# EasyEDA Pro project ProProject_8通道遥控器控制板_2024-05-28.epro

# Schematic schematic1
Create Date: 2024-05-23; Page Name: P1; Project Name: 8通道遥控器控制板; Schematic Name: schematic1; Update Date: 2024-05-23; Company: 嘉立创EDA; Drawed: Date20240523; Page Size: A4; Version: V1.0
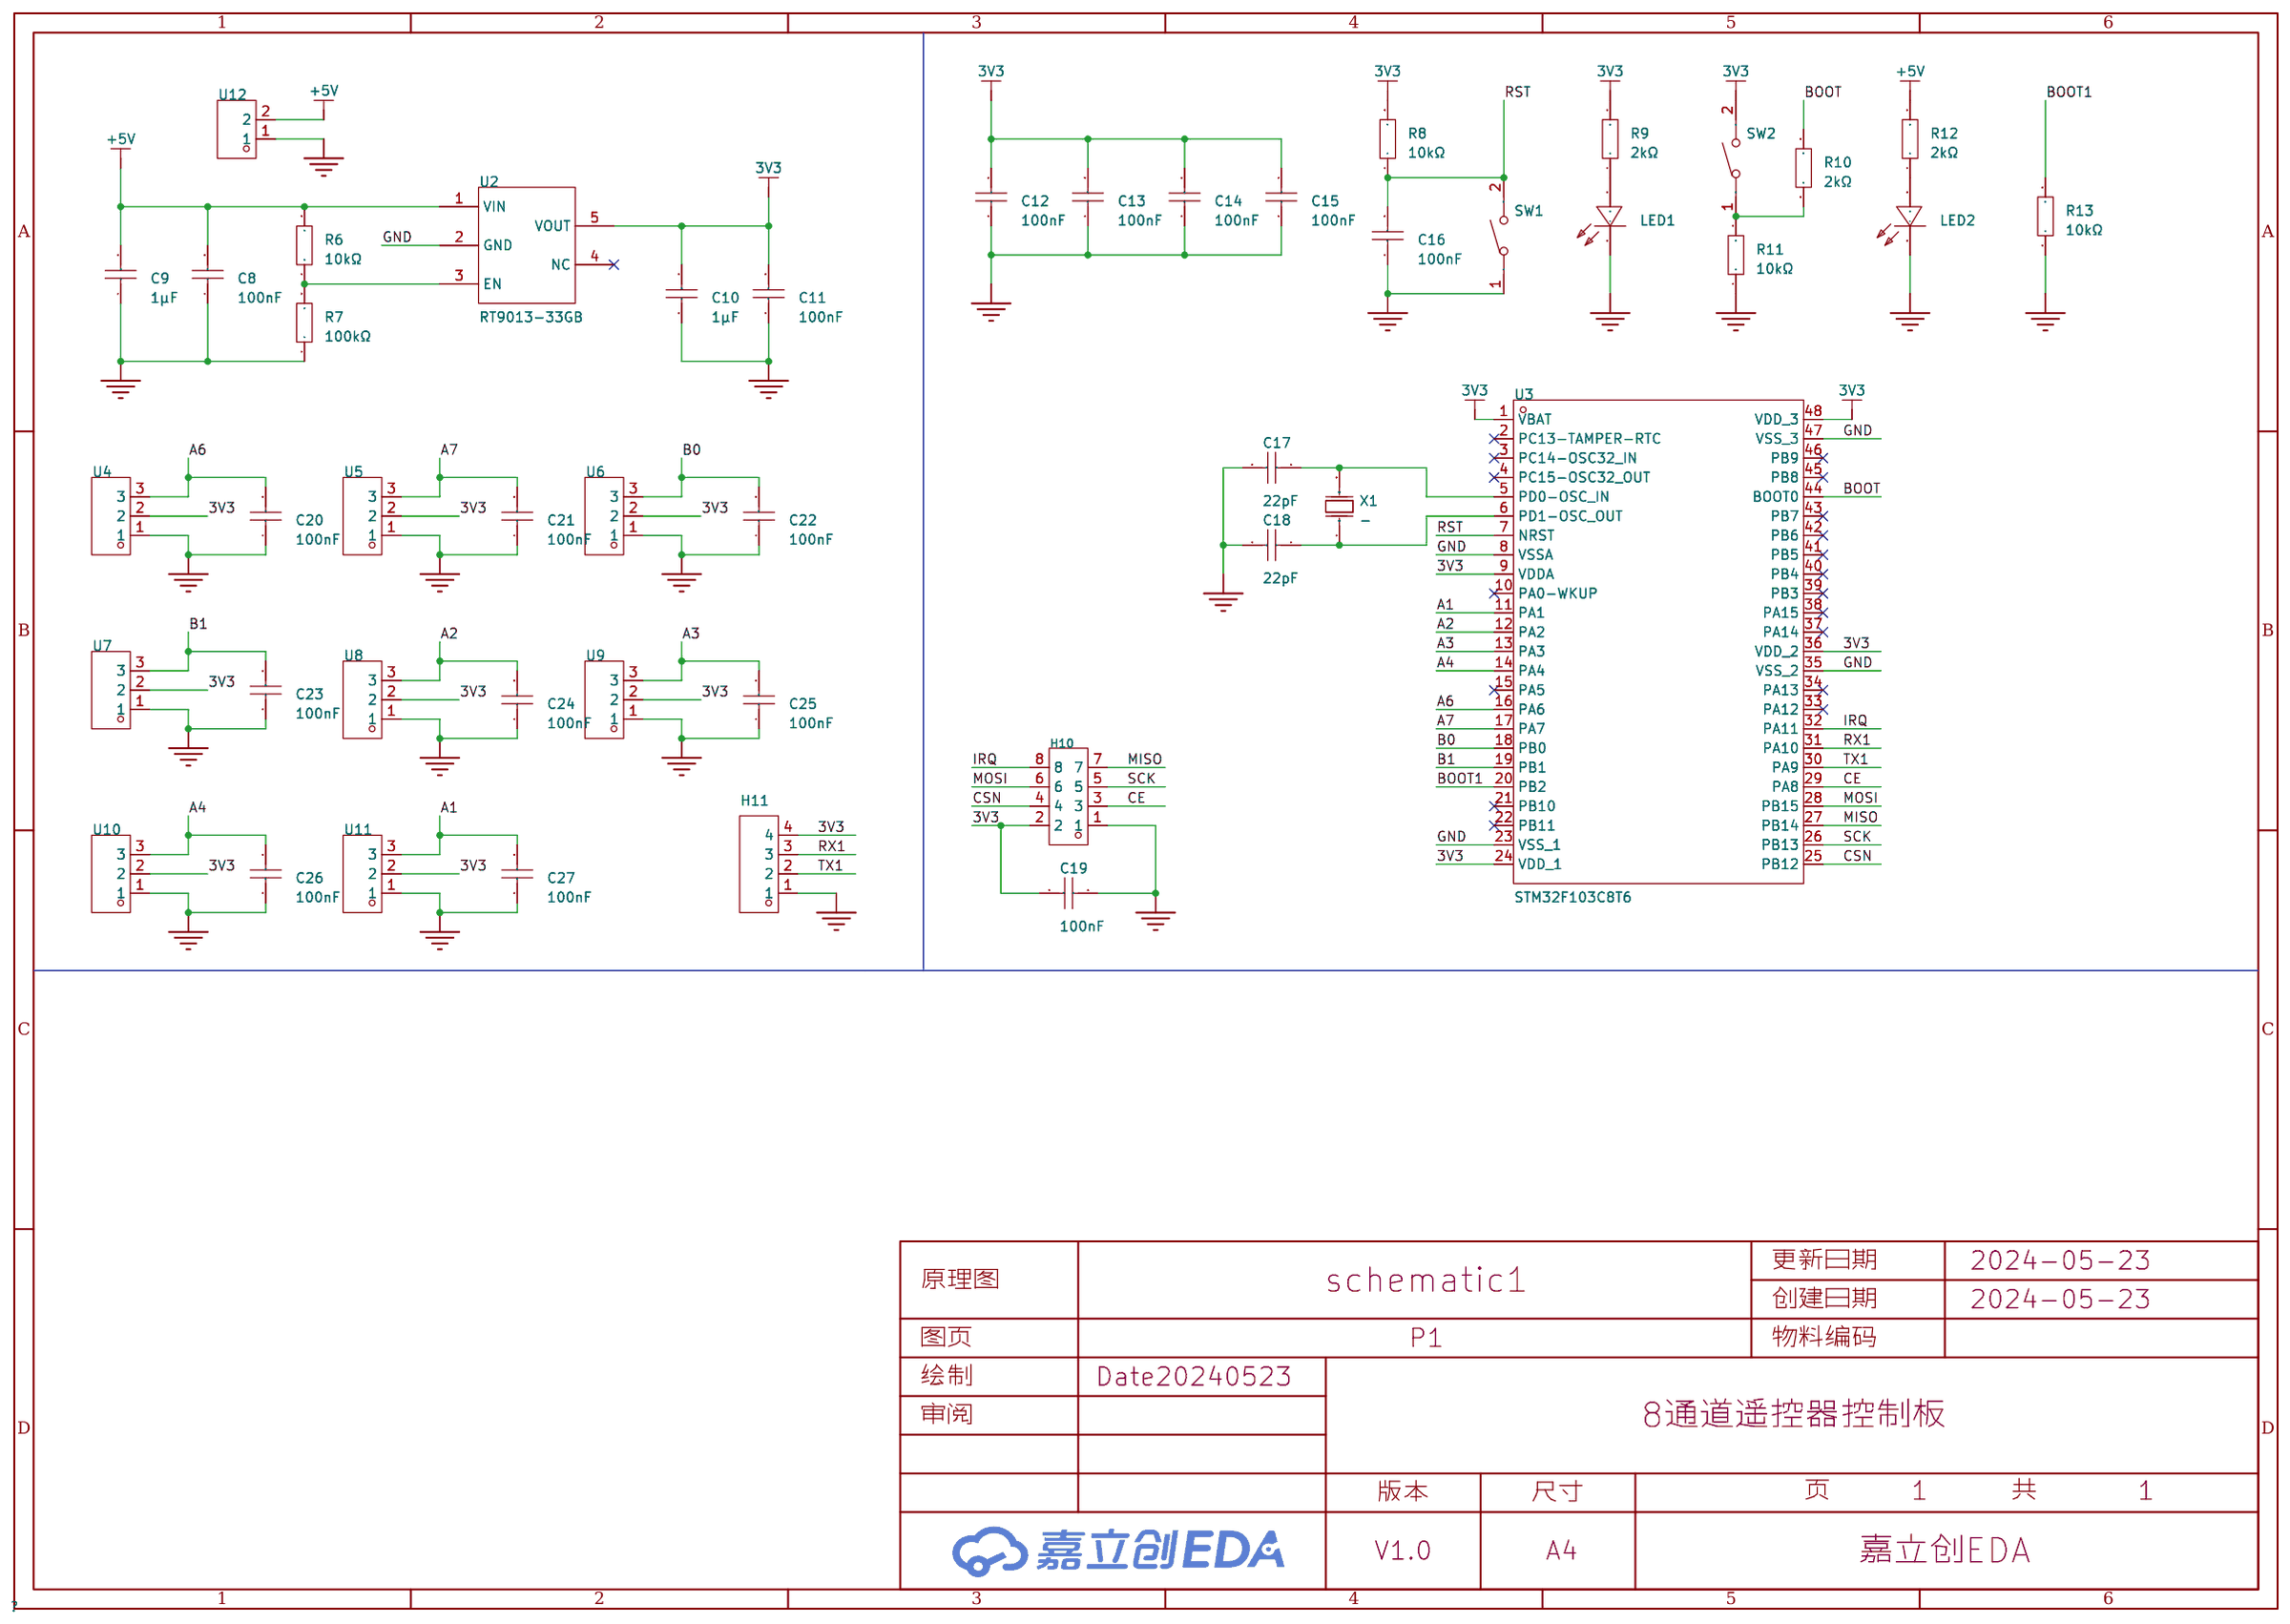
[diagram p0: schematic sheet]

## Parts
C8  100nF  [C0805]
C9  1μF  [C0805]
C10  1μF  [C0805]
C11  100nF  [C0805]
C12  100nF  [C0805]
C13  100nF  [C0805]
C14  100nF  [C0805]
C15  100nF  [C0805]
C16  100nF  [C0805]
C17  22pF  [C0805]
C18  22pF  [C0805]
C19  100nF  [C0805]
C20  100nF  [C0805]
C21  100nF  [C0805]
C22  100nF  [C0805]
C23  100nF  [C0805]
C24  100nF  [C0805]
C25  100nF  [C0805]
C26  100nF  [C0805]
C27  100nF  [C0805]
H10  PZ254V-12-8P  [HDR-TH_8P-P2.54-V-M-R2-C4-S2.54]
H11  PZ254V-11-04P  [HDR-TH_4P-P2.54-V-M]
LED1  SZYY0603G  [LED0603-R-RD_GREEN]
LED2  SZYY0603G  [LED0603-R-RD_GREEN]
R6  10kΩ  [R0603]
R7  100kΩ  [R0603]
R8  10kΩ  [R0603]
R9  2kΩ  [R0603]
R10  2kΩ  [R0603]
R11  10kΩ  [R0603]
R12  2kΩ  [R0603]
R13  10kΩ  [R0603]
SW1  TS-1088-AR02016  [SW-SMD_L3.9-W3.0-P4.45]
SW2  TS-1088-AR02016  [SW-SMD_L3.9-W3.0-P4.45]
U2  RT9013-33GB  [SOT-23-5_L3.0-W1.7-P0.95-LS2.8-BL]
U3  STM32F103C8T6  [LQFP-48_L7.0-W7.0-P0.50-LS9.0-BL]
U4  ZX-XH2.54-3PZZ  [CONN-TH_3P-P2.54_2501S-3P]
U5  ZX-XH2.54-3PZZ  [CONN-TH_3P-P2.54_2501S-3P]
U6  ZX-XH2.54-3PZZ  [CONN-TH_3P-P2.54_2501S-3P]
U7  ZX-XH2.54-3PZZ  [CONN-TH_3P-P2.54_2501S-3P]
U8  ZX-XH2.54-3PZZ  [CONN-TH_3P-P2.54_2501S-3P]
U9  ZX-XH2.54-3PZZ  [CONN-TH_3P-P2.54_2501S-3P]
U10  ZX-XH2.54-3PZZ  [CONN-TH_3P-P2.54_2501S-3P]
U11  ZX-XH2.54-3PZZ  [CONN-TH_3P-P2.54_2501S-3P]
U12  DB125-3.81-2P-GN-S  [CONN-TH_2P-P3.81_L7.4-W7.6]
X1  -  [HC-49S_L11.4-W4.8]

## Library data of the parts
C8-C27 = CC0805KRX7R9BB104: 容值:100nF;精度:±10%;额定电压:50V;材质(温度系数):X7R;; LCSC Part Name: 100nF ±10% 50V; Supplier Part: C49678; Manufacturer: YAGEO(国巨); Supplier Footprint: 0805; JLCPCB Part Class: 基础库; Datasheet: https://atta.szlcsc.com/upload/public/pdf/source/20180224/C181747_15194369449651363981.pdf; Supplier: LCSC; Tolerance: ±10%; Voltage Rated: 50V; Temperature Coefficient: X7R
H10 = PZ254V-12-8P: 插针结构:2x4P;间距:2.54mm;行距:2.54mm;圆针/方针:方针;安装类型:直插;排数:双排;总PIN位数:8P;额定电流:-;额定电压:-;配合针长度:6mm;塑高:2.5mm;端接针长度:3mm;触头材质:黄铜;触头镀层:-;工作温度范围:-40℃~+105℃;颜色:黑色;; LCSC Part Name: 间距:2.54mm 2x4P 直插 方针; Supplier Part: C492421; Manufacturer: XFCN(兴飞); Supplier Footprint: 插件,P=2.54mm; JLCPCB Part Class: 扩展库; Datasheet: https://atta.szlcsc.com/upload/public/pdf/source/20200309/C492421_DC8A206AF99CD7755BD4A5B0BC48200B.pdf; Supplier: LCSC; Pin Structure: 2x4P; Pitch: 2.54mm; Row Spacing: 2.54mm; Circluar Pins/Square Pins: 方针; Mounting Type: 直插; Number of Rows: 双排; Number of Pins: 8P; Length of Mating Pin: 6mm; Insulation Height: 2.5mm; Length of End Connection Pin: 3mm; Contact Material: 黄铜; Operating Temperature Range: -40℃~+105℃; Color: 黑色
H11 = PZ254V-11-04P: 插针结构:1x4P;间距:2.54mm;行距:-;圆针/方针:方针;安装类型:直插;排数:单排;总PIN位数:4P;额定电流:3A;额定电压:250V;配合针长度:6mm;塑高:2.5mm;端接针长度:3mm;触头材质:-;工作温度范围:-40℃~+105℃;颜色:黑色;; LCSC Part Name: 间距:2.54mm 1x4P 直插 方针; Supplier Part: C2691448; Manufacturer: XFCN(兴飞); Supplier Footprint: 插件,P=2.54mm; JLCPCB Part Class: 扩展库; Datasheet: https://atta.szlcsc.com/upload/public/pdf/source/20200309/C492403_F9F19131791D08044AD4F84F8E751A34.pdf; Supplier: LCSC; Pin Structure: 1x4P; Pitch: 2.54mm; Circluar Pins/Square Pins: 方针; Mounting Type: 直插; Number of Rows: 单排; Number of Pins: 4P; Current Rating (Max): 3A; Voltage Rating (Max): 250V; Length of Mating Pin: 6mm; Insulation Height: 2.5mm; Length of End Connection Pin: 3mm; Operating Temperature Range: -40℃~+105℃; Color: 黑色
LED1 LED2 = SZYY0603G: 发光颜色:翠绿色;; LCSC Part Name: 翠绿; Supplier Part: C434420; Manufacturer: yongyu(永裕光电); Supplier Footprint: 0603; JLCPCB Part Class: 扩展库; Datasheet: https://atta.szlcsc.com/upload/public/pdf/source/20191204/C434420_28D8AC31297B1E2177F31D28DAFFED5A.pdf; Supplier: LCSC; Emitted Color: 翠绿色
R6-R13 = 0603WAF1001T5E: 电阻类型:厚膜电阻;阻值:1kΩ;精度:±1%;功率:100mW;最大工作电压:75V;温度系数:±100ppm/℃;; LCSC Part Name: 1kΩ ±1% 100mW 厚膜电阻; Supplier Part: C21190; Manufacturer: UNI-ROYAL(厚声); Supplier Footprint: 0603; JLCPCB Part Class: 基础库; Datasheet: https://atta.szlcsc.com/upload/public/pdf/source/20200306/C422600_1E6D84923E4A46A82E41ADD87F860B5C.pdf; Supplier: LCSC; Type: 厚膜电阻; Tolerance: ±1%; Power(Watts): 100mW; Overload Voltage (Max): 75V; Temperature Coefficient: ±100ppm/℃; Operating Temperature Range: -55℃~+155℃
SW1 SW2 = TS-1088-AR02016: 电路结构:单刀单掷;按钮形状:圆形按钮;作用力:160gf;安装方式:立贴;开关长度:4mm;开关宽度:3mm;开关高度:2mm;带支架:不带;触点电流:50mA;额定电压(DC):12V;绝缘电阻:100MΩ;机械寿命:10万次;; LCSC Part Name: 4*3*2mm 立贴 轻触开关; Supplier Part: C720477; Manufacturer: XUNPU(讯普); Supplier Footprint: SMD; JLCPCB Part Class: 扩展库; Datasheet: https://atta.szlcsc.com/upload/public/pdf/source/20200810/C720475_60D09DD6C54279ADDB2DC25100F1CC11.pdf; Supplier: LCSC; Circuit: 单刀单掷; Actuator Style: 圆形按钮; Operating Force: 160gf; Mounting Style: 立贴; Switch Length: 4mm; Switch Width: 3mm; Switch Height: 2mm; Strike Gundam: 不带; Contact Current: 50mA; Voltage Rating (DC): 12V; Insulation Resistance: 100MΩ; Actuator/Cap Color: 黑色; Pin Style: SMD接片; Mechanical Life: 10万次; Operating Temperature: -30℃~+80℃
U2 = RT9013-33GB: 输出类型:固定;最大输入电压:5.5V;输出电压:3.3V;最大输出电流:500mA;电源纹波抑制比(PSRR):50dB@(10kHz);输出极性:正极;; LCSC Part Name: 输入5.5V 输出3.3V 500mA; Supplier Part: C47773; Manufacturer: RICHTEK(立锜); Supplier Footprint: SOT-23-5; JLCPCB Part Class: 扩展库; Datasheet: https://atta.szlcsc.com/upload/public/pdf/source/20150504/1457707282459.pdf; Supplier: LCSC; Output Type: 固定; Maximum Input Voltage: 5.5V; Output Voltage: 3.3V; MAX Output Current: 500mA; Power Supply Rejection Ratio (PSRR): 50dB@(10kHz); Dropout Voltage: 400mV@(500mA); standby current: 50uA; Operating Temperature: -40℃~+85℃; Output Polarity: 正极; Number of Outputs: 1
U3 = STM32F103C8T6: CPU内核:CM3;程序存储容量:64KB;RAM总容量:20KB;GPIO端口数量:37;工作电压范围:2V~3.6V;CPU最大主频:72MHz;程序存储器类型:FLASH;; LCSC Part Name: STM32F103C8T6 MSL=3; Supplier Part: C8734; Manufacturer: ST(意法半导体); Supplier Footprint: LQFP-48(7x7); JLCPCB Part Class: 扩展库; Datasheet: https://atta.szlcsc.com/upload/public/pdf/source/20220812/8363ACEC51AD55ECEB84799464F7CB85.pdf; Supplier: LCSC; CPU Core: CM3; Program Storage Size: 64KB; RAM Size: 20KB; GPIO Ports Number: 37; Operating Voltage Range: 2V~3.6V; CPU Maximum Speed: 72MHz; Program Memory Type: FLASH; Operating Temperature Range: -40℃~+85℃; ADC (Bit): 12bit; Universal Serial Bus: 有; Peripheral/Function: 看门狗；DMA；看门狗；片载温度传感器; Watchdog: 有; Infrared Data Association: 有; Low-Voltage Detect: 有; Direct Memory Access: 有; Internal Oscillator: 有
U4-U11 = ZX-XH2.54-3PZZ: 插针结构:1x3P;间距:2.54mm;安装方式:直插;参考系列:XH;总PIN数:3P;排数:1;每排PIN数:3;行距:-;额定电流:3A;触头材质:黄铜;触头镀层:锡;工作温度范围:-25℃~+85℃;; Supplier Part: C7429633; Manufacturer: Megastar(兆星); Supplier Footprint: 插件,P=2.54mm; JLCPCB Part Class: 扩展库; Datasheet: https://atta.szlcsc.com/upload/public/pdf/source/20230619/AE17037A2CFDBE8D9CBA775D61AD0A84.pdf; Supplier: LCSC; Pins Structure: 1x3P; Pitch: 2.54mm; Mounting Style: 直插; Reference Series: XH; Number of Pins: 3P; Number of Rows: 1; Number of PINs Per Row: 3; Current Rating (Max): 3A; Contact Material: 黄铜; Contact Plating: 锡; Operating Temperature Range: -25℃~+85℃
U12 = DB125-3.81-2P-GN-S: 结构:1x2P;间距:3.81mm;颜色:绿色;安装方式:直插;额定电流:10A;额定电压:300V;排数:1;线规 - AWG:16~26;线规 - 平方毫米:0.5~1;每排PIN数:2;工作温度范围:-40℃~+105℃;; LCSC Part Name: 3.81mm 1x2P 排数:1 每排P数:2 直插; Supplier Part: C395878; Manufacturer: DORABO(地博电气); Supplier Footprint: 插件,P=3.81mm; JLCPCB Part Class: 扩展库; Datasheet: https://atta.szlcsc.com/upload/public/pdf/source/20220823/CB89165D0F406880B925A92BEEA3FB50.pdf; Supplier: LCSC; Structure: 1x2P; Pitch: 3.81mm; Color: 绿色; Mounting Style: 直插; Current Rating (Max): 10A; Voltage Rating (Max): 300V; Number of Pins: 2P; Number of Rows: 1; Wire Gauge - AWG: 16~26; Wire Gauge - mm2: 0.5~1; Number of PINs Per Row: 2; Operating Temperature Range: -40℃~+105℃
X1 = 9C08000003: 晶振类型:-;频率:-;外接负载电容:-;; LCSC Part Name: HC-49SMD 8M 20pF 20ppm; Supplier Part: C90937; Manufacturer: TXC(晶技); Supplier Footprint: HC-49S-SMD; JLCPCB Part Class: 扩展库; Datasheet: https://atta.szlcsc.com/upload/public/pdf/source/20180620/C97215_B58DD94CBE95359F5BF09D54E0633036.pdf; Supplier: LCSC

## Nets
3V3: C10.2 C11.2 C12.2 C13.2 C14.2 C15.2 C19.1 H10.2 H11.4 R8.2 R9.2 SW2.2 U2.5(VOUT) U3.1(VBAT) U3.9(VDDA) U3.24(VDD_1) U3.36(VDD_2) U3.48(VDD_3) U4.2 U5.2 U6.2 U7.2 U8.2 U9.2 U10.2 U11.2
+5V: C8.2 C9.2 R6.2 R12.2 U2.1(VIN) U12.2
GND: C8.1 C9.1 C10.1 C11.1 C12.1 C13.1 C14.1 C15.1 C16.1 C17.2 C18.2 C19.2 C20.1 C21.1 C22.1 C23.1 C24.1 C25.1 C26.1 C27.1 H10.1 H11.1 LED1.2(-) LED2.2(-) R7.1 R11.1 R13.1 SW1.1 U2.2(GND) U3.8(VSSA) U3.23(VSS_1) U3.35(VSS_2) U3.47(VSS_3) U4.1 U5.1 U6.1 U7.1 U8.1 U9.1 U10.1 U11.1 U12.1
A1: C27.2 U3.11(PA1) U11.3
A2: C24.2 U3.12(PA2) U8.3
A3: C25.2 U3.13(PA3) U9.3
A4: C26.2 U3.14(PA4) U10.3
A6: C20.2 U3.16(PA6) U4.3
A7: C21.2 U3.17(PA7) U5.3
B0: C22.2 U3.18(PB0) U6.3
B1: C23.2 U3.19(PB1) U7.3
BOOT: R10.2 U3.44(BOOT0)
BOOT1: R13.2 U3.20(PB2)
CE: H10.3 U3.29(PA8)
CSN: H10.4 U3.25(PB12)
IRQ: H10.8 U3.32(PA11)
MISO: H10.7 U3.27(PB14)
MOSI: H10.6 U3.28(PB15)
RST: C16.2 R8.1 SW1.2 U3.7(NRST)
RX1: H11.3 U3.31(PA10)
SCK: H10.5 U3.26(PB13)
TX1: H11.2 U3.30(PA9)
$1N1468: R6.1 R7.2 U2.3(EN)
$1N2320: LED1.1(+) R9.1
$1N2563: R10.1 R11.2 SW2.1
$1N2663: LED2.1(+) R12.1
$1N3311: C18.1 U3.6(PD1-OSC_OUT) X1.1(OSC1)
$1N3317: C17.1 U3.5(PD0-OSC_IN) X1.2(OSC2)

Not connected (* = marked no-connect by the designer): U2 4(NC)*; U3 2(PC13-TAMPER-RTC)* 3(PC14-OSC32_IN)* 4(PC15-OSC32_OUT)* 10(PA0-WKUP)* 15(PA5)* 21(PB10)* 22(PB11)* 33(PA12)* 34(PA13)* 37(PA14)* 38(PA15)* 39(PB3)* 40(PB4)* 41(PB5)* 42(PB6)* 43(PB7)* 45(PB8)* 46(PB9)*

# Board PCB1
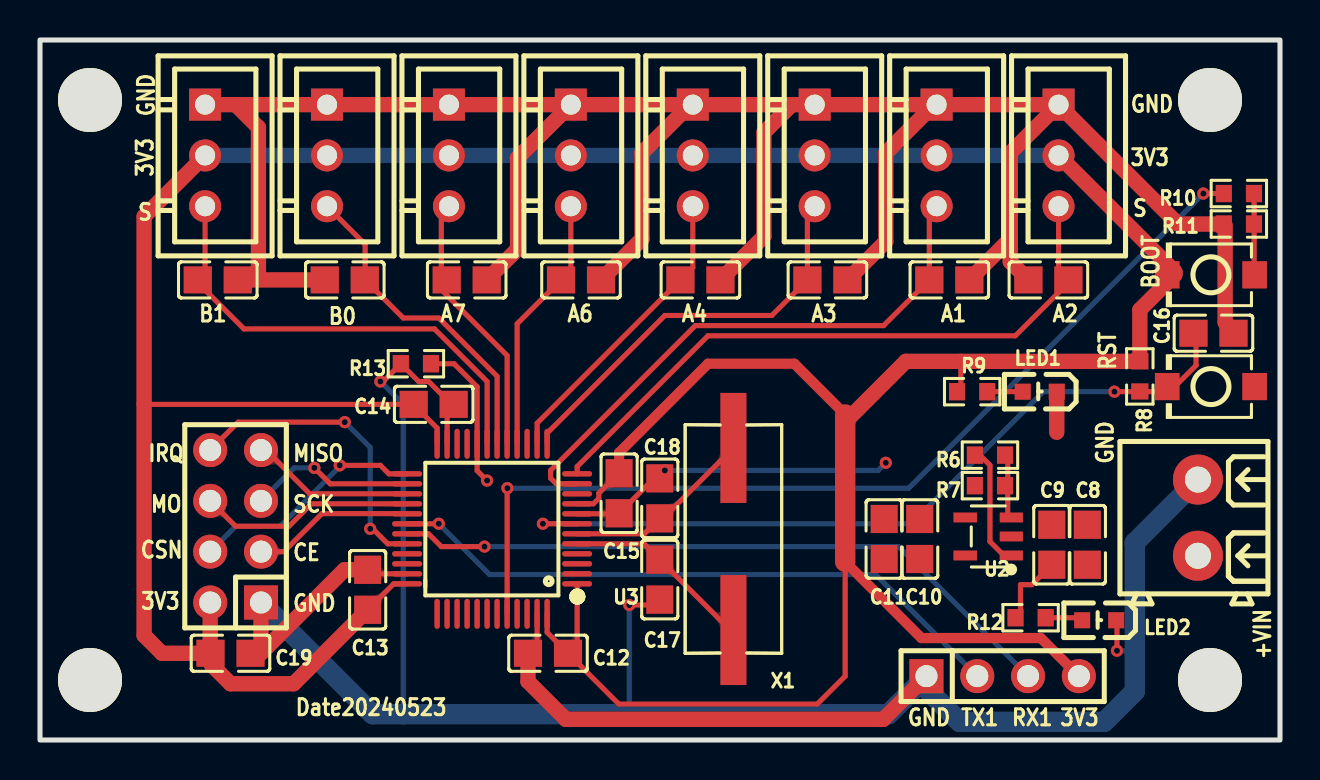
[diagram p1: board, top side]
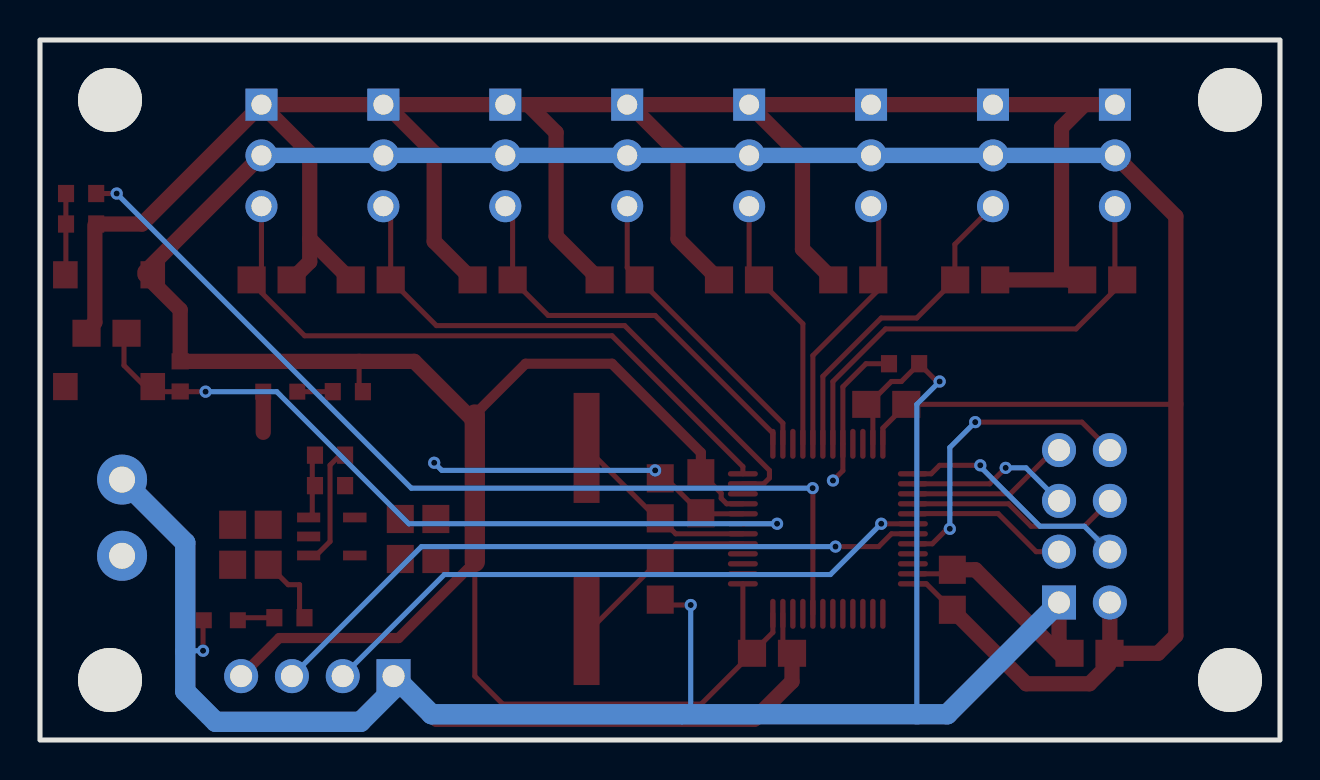
[diagram p2: board, bottom side, seen from below]

Outline 62 x 35 mm; copper layers: Top Layer, Bottom Layer. Coordinates in mm from the lower left corner of the outline.
Outline path: rectangle 0,35 62,0
Stack: Top Layer 0.035mm / Dielectric1 1.51mm FR4 er 4.5 / Bottom Layer 0.035mm

## Design rules (mm)
template: 自定义配置
spacing copperThickness1oz (default): track to track 0.102, other pairs 0.152 to 0.3
spacing copperThickness2oz: track to track 0.203, other pairs 0.152 to 0.3
track width copperThickness1oz (default): min 0.127, default 0.254, max 2.54
track width copperThickness2oz: min 0.203, default 0.254, max 2.54
differential pair differentialPair (default): width min 0.127, default 0.254, max 2.54; gap min 0.152, default 0.152
via viaSize (default): diameter min 0.5, default 0.61, max 10; hole min 0.3, default 0.305, max 6.3

## Placement (name value [footprint] x y rotation side)
C8  100nF  [C0805]  52.37 9.76 270 top
C9  1μF  [C0805]  50.59 9.76 270 top
C10  1μF  [C0805]  43.99 10.05 270 top
C11  100nF  [C0805]  42.21 10.05 270 top
C12  100nF  [C0805]  25.4 4.34 0 top
C13  100nF  [C0805]  16.38 7.51 270 top
C14  100nF  [C0805]  19.69 16.78 180 top
C15  100nF  [C0805]  28.96 12.34 90 top
C16  100nF  [C0805]  58.67 20.34 180 top
C17  22pF  [C0805]  30.99 8.02 270 top
C18  22pF  [C0805]  30.99 12.08 90 top
C19  100nF  [C0805]  9.52 4.34 0 top
C20  100nF  [C0805]  27.05 23 180 top
C21  100nF  [C0805]  21.34 23 180 top
C22  100nF  [C0805]  15.24 23 0 top
C23  100nF  [C0805]  8.89 23 180 top
C24  100nF  [C0805]  50.42 23 0 top
C25  100nF  [C0805]  39.37 23 180 top
C26  100nF  [C0805]  33.02 23 180 top
C27  100nF  [C0805]  45.47 23 180 top
H10  PZ254V-12-8P  [HDR-TH_8P-P2.54-V-M-R2-C4-S2.54]  9.78 10.69 90 top
H11  PZ254V-11-04P  [HDR-TH_4P-P2.54-V-M]  48.13 3.19 0 top
LED1  SZYY0603G  [LED0603-R-RD_GREEN]  49.99 17.42 180 top
LED2  SZYY0603G  [LED0603-R-RD_GREEN]  52.96 5.99 180 top
NOREF  -  [Pad_e88]  58.5 32 0 top
NOREF#2  -  [Pad_e86]  2.5 32 0 top
NOREF#3  -  [Pad_e93]  58.5 3 0 top
NOREF#4  -  [Pad_e91]  2.5 3 0 top
R6  10kΩ  [R0603]  47.5 14.24 180 top
R7  100kΩ  [R0603]  47.5 12.72 0 top
R8  10kΩ  [R0603]  54.99 18.18 90 top
R9  2kΩ  [R0603]  46.61 17.42 180 top
R10  2kΩ  [R0603]  59.94 27.32 180 top
R11  10kΩ  [R0603]  59.94 25.8 0 top
R12  2kΩ  [R0603]  49.53 6.11 180 top
R13  10kΩ  [R0603]  18.8 18.81 0 top
SW1  TS-1088-AR02016  [SW-SMD_L3.9-W3.0-P4.45]  58.55 17.67 180 top
SW2  TS-1088-AR02016  [SW-SMD_L3.9-W3.0-P4.45]  58.55 23.26 180 top
U2  RT9013-33GB  [SOT-23-5_L3.0-W1.7-P0.95-LS2.8-BL]  47.41 10.18 90 top
U3  STM32F103C8T6  [LQFP-48_L7.0-W7.0-P0.50-LS9.0-BL]  22.61 10.56 90 top
U4  ZX-XH2.54-3PZZ  [CONN-TH_3P-P2.54_2501S-3P]  26.54 29.23 270 top
U5  ZX-XH2.54-3PZZ  [CONN-TH_3P-P2.54_2501S-3P]  20.45 29.23 270 top
U6  ZX-XH2.54-3PZZ  [CONN-TH_3P-P2.54_2501S-3P]  14.35 29.23 270 top
U7  ZX-XH2.54-3PZZ  [CONN-TH_3P-P2.54_2501S-3P]  8.26 29.23 270 top
U8  ZX-XH2.54-3PZZ  [CONN-TH_3P-P2.54_2501S-3P]  50.93 29.23 270 top
U9  ZX-XH2.54-3PZZ  [CONN-TH_3P-P2.54_2501S-3P]  38.73 29.23 270 top
U10  ZX-XH2.54-3PZZ  [CONN-TH_3P-P2.54_2501S-3P]  32.64 29.23 270 top
U11  ZX-XH2.54-3PZZ  [CONN-TH_3P-P2.54_2501S-3P]  44.83 29.23 270 top
U12  DB125-3.81-2P-GN-S  [CONN-TH_2P-P3.81_L7.4-W7.6]  57.9 11.12 270 top
X1  -  [HC-49S_L11.4-W4.8]  34.67 10.05 270 top

## Footprints (pads in the part's own frame, mm; a bottom-side part is the same pattern mirrored in y, then rotated)
C0805
  rect 1.41x1.35 smd: 1(-1,0) 2(1,0)
CONN-TH_2P-P3.81_L7.4-W7.6
  round 2.5 hole 1.3: 1(-1.905,0) 2(1.905,0)
CONN-TH_3P-P2.54_2501S-3P
  rect 1.6x1.6 hole 1: 1(-2.54,0)
  round 1.6 hole 1: 2(0,0) 3(2.54,0)
HC-49S_L11.4-W4.8
  rect 5.5x1.3 smd: 1(-4.553,0) 2(4.553,0)
HDR-TH_4P-P2.54-V-M
  rect 1.7x1.7 hole 1.1: 1(-3.81,0)
  round 1.7 hole 1.1: 2(-1.27,0) 3(1.27,0) 4(3.81,0)
HDR-TH_8P-P2.54-V-M-R2-C4-S2.54
  rect 1.7x1.7 hole 1.1: 1(-3.81,-1.27)
  round 1.7 hole 1.1: 2(-3.81,1.27) 3(-1.27,-1.27) 4(-1.27,1.27) 5(1.27,-1.27) 6(1.27,1.27) 7(3.81,-1.27) 8(3.81,1.27)
LED0603-R-RD_GREEN
  rect 0.8x0.8 smd: 1(0.851,0) 2(-0.851,0)
LQFP-48_L7.0-W7.0-P0.50-LS9.0-BL
  oval 0.27x1.5 smd: 1(-2.75,-4.25) 2(-2.25,-4.25) 3(-1.75,-4.25) 4(-1.25,-4.25) 5(-0.75,-4.25) 6(-0.25,-4.25) 7(0.25,-4.25) 8(0.75,-4.25) 9(1.25,-4.25) 10(1.75,-4.25) 11(2.25,-4.25) 12(2.75,-4.25) 25(2.75,4.25) 26(2.25,4.25) 27(1.75,4.25) 28(1.25,4.25) 29(0.75,4.25) 30(0.25,4.25) 31(-0.25,4.25) 32(-0.75,4.25) 33(-1.25,4.25) 34(-1.75,4.25) 35(-2.25,4.25) 36(-2.75,4.25)
  oval 1.5x0.27 smd: 13(4.25,-2.75) 14(4.25,-2.25) 15(4.25,-1.75) 16(4.25,-1.25) 17(4.25,-0.75) 18(4.25,-0.25) 19(4.25,0.25) 20(4.25,0.75) 21(4.25,1.25) 22(4.25,1.75) 23(4.25,2.25) 24(4.25,2.75) 37(-4.25,2.75) 38(-4.25,2.25) 39(-4.25,1.75) 40(-4.25,1.25) 41(-4.25,0.75) 42(-4.25,0.25) 43(-4.25,-0.25) 44(-4.25,-0.75) 45(-4.25,-1.25) 46(-4.25,-1.75) 47(-4.25,-2.25) 48(-4.25,-2.75)
Pad_e86
  round 3.2 hole 3.2: 49(0,0)
Pad_e88
  round 3.2 hole 3.2: 50(0,0)
Pad_e91
  round 3.2 hole 3.2: 51(0,0)
Pad_e93
  round 3.2 hole 3.2: 52(0,0)
R0603
  rect 0.806x0.864 smd: 1(-0.753,0) 2(0.753,0)
SOT-23-5_L3.0-W1.7-P0.95-LS2.8-BL
  rect 0.49x1.157 smd: 1(-0.95,-1.153) 2(0,-1.153) 3(0.95,-1.153)
  rect 0.49x1.175 smd: 4(0.95,1.153) 5(-0.95,1.153)
SW-SMD_L3.9-W3.0-P4.45
  rect 1.23x1.36 smd: 1(-2.185,0) 2(2.185,0)

## Nets
As in the schematic.

Pads without a net: NOREF 50; NOREF#2 49; NOREF#3 52; NOREF#4 51; U2 4; U3 2 3 4 10 15 21 22 33 34 37 38 39 40 41 42 43 45 46

## Via types
v1: diameter 0.61, hole 0.305, Top Layer to Bottom Layer, 16 vias

## Routing (per net, layer and track width the routed paths; a pad name or vN(x,y) marks a point on that pad's centre or on a via; arc(x,y) is an arc through that point)
3V3: length 200.9
  Top Layer w0.254: U3.48 25.36,5.38 C12.2 ; 18.81,16.78 18.81,16.64 19.86,15.59 U3.24 ; C12.2 28.94,1.8 38.86,1.8 40.26,3.19 40.26,8.91 ; C12.2 26.86,4.79 U3.1 ; C13.2 17.68,7.81 U3.36 ; U3.9 27.67,11.81 27.94,12.08 27.94,12.34 28.94,13.34 C15.2 ; 46.04,18.93 46.04,17.61 R9.2 ; 5.21,16.8 5.22,16.78 C14.2
  Top Layer w0.508: 40.26,8.91 44.07,5.1 50.04,5.1 H11.4 ; 8.78,4.34 8.51,4.61 ; 40.26,16.27 37.72,18.81 33.4,18.81 28.96,14.37 C15.2
  Top Layer w0.762: 8.51,4.61 H10.2 ; 8.78,4.34 8.57,4.13 8.57,3.76 9.52,2.81 12.68,2.81 C13.2 ; U8.2 56.74,23.41 56.74,23.26 54.99,21.51 R8.2 43.29,18.93 40.26,15.9 ; U7.2 5.21,26.18 5.21,5.22 6.1,4.34 C19.1
  Top Layer w1.016: 40.26,8.91 40.26,16.27
  Bottom Layer w0.762: U8.2 U11.2 U9.2 U10.2 U4.2 U5.2 U6.2 U7.2
+5V: length 9.6
  Top Layer w0.254: R12.2 49.02,6.36 49.02,7.77 49.59,7.77 C9.2 ; U2.1 48.2,9.23 47.5,9.92 47.5,13.74 47,14.24
GND: length 278.2
  Top Layer w0.254: v1(29.46,6.75) 30.72,6.75 C17.2 ; U3.47 24.86,4.79 C12.1 ; C13.1 16.58,8.31 U3.35 ; C14.1 20.57,16.78 19.43,17.92 18.93,17.92 R13.1 17.15,17.92 v1(17.02,17.92) ; v1(53.85,4.46) 53.85,5.95 LED2.2 ; U3.8 28.93,11.31 C15.1 30.7,13.08 C18.2 ; U3.23 20.36,16.33 20.81,16.78 ; R11.1 59.26,25.73
  Top Layer w0.762: U8.1 U11.1 44.7,31.77 ; U8.1 48.51,29.36 48.51,25.05 ; U8.1 56.9,25.8 R11.1 ; C20.1 30.1,25.05 30.1,29.36 32.51,31.77 ; C25.1 42.29,24.93 42.29,29.36 44.7,31.77 ; C27.1 48.51,25.05 ; 48.51,25.05 48.51,23.91 C24.1 ; C23.1 10.54,23 ; 10.54,23 10.92,23.39 10.92,30.62 9.78,31.77 ; 10.54,23 C22.1 ; U7.1 9.78,31.77 ; 9.78,31.77 U6.1 U5.1 U4.1 ; H10.1 11.05,4.86 C19.2 ; 37.59,31.77 U10.1 32.51,31.77 ; 37.59,31.77 U9.1 44.7,31.77 ; 37.59,31.77 36.2,30.37 36.2,25.18 C26.1 ; 32.51,31.77 U4.1 ; 59.26,25.73 59.26,20.88 59.8,20.34 ; C12.1 24.4,2.92 26.29,1.03 42.16,1.03 H11.1 ; C13.1 15.22,8.51 10.8,4.08 ; U4.1 23.88,29.1 23.88,24.55 C21.1 ; LED1.2 50.84,15.39
  Bottom Layer w0.254: v1(17.02,17.92) 18.16,16.78 18.16,1.29 17.91,1.03 ; v1(31.24,13.48) 41.91,13.48 v1(42.29,13.86) ; v1(29.46,6.75) 29.46,1.71 29.89,1.29 ; 54.74,4.41 54.68,4.46 v1(53.85,4.46)
  Bottom Layer w1.016: H10.1 16.64,1.29 42.42,1.29 H11.1 44.32,2.56 45.97,0.91 53.21,0.91 54.74,2.43 54.74,9.86 U12.1
A1: length 28.5
  Top Layer w0.254: U11.3 44.47,26.32 C27.2 42.18,20.72 32.77,20.72 25.53,13.48 25.53,13.1 25.82,12.81 U3.11
A2: length 32.4
  Top Layer w0.254: U8.3 50.93,22.37 48.77,20.21 33.4,20.21 26.86,13.67 U3.12
A3: length 20.6
  Top Layer w0.254: U9.3 38.37,26.32 C25.2 36.59,21.23 31.24,21.23 25.36,15.34 U3.13
A4: length 15.1
  Top Layer w0.254: U10.3 32.64,23.62 C26.2 24.86,15.84 U3.14
A6: length 13
  Top Layer w0.254: U3.16 23.86,20.81 C20.2 26.54,23.5 U4.3
A7: length 13.4
  Top Layer w0.254: U5.3 20.07,26.31 20.07,22.51 23.36,19.22 U3.17
B0: length 16.4
  Top Layer w0.254: U6.3 16.26,24.78 16.26,23 18.16,21.1 19.94,21.1 22.86,18.18 U3.18
B1: length 23.3
  Top Layer w0.254: U3.19 22.36,17.92 19.72,20.55 10.2,20.55 8.26,22.5 U7.3
BOOT: length 48.2
  Top Layer w0.254: U3.44 23.36,12.58 v1(23.37,12.59) ; v1(58.17,27.32) 59.18,27.32
  Bottom Layer w0.254: v1(58.17,27.32) 43.43,12.59 v1(23.37,12.59)
BOOT1: length 7.7
  Top Layer w0.254: R13.2 20.7,18.81 21.86,17.66 U3.20 21.86,13.47 v1(22.35,12.97)
CE: length 8.1
  Top Layer w0.254: H10.3 12.19,9.42 14.1,11.32 18.34,11.32 U3.29
CSN: length 11.8
  Top Layer w0.254: U3.25 17.44,13.31 17.02,13.73 v1(14.99,13.73)
  Bottom Layer w0.254: H10.4 9.78,10.69 12,10.69 14.99,13.67 v1(14.99,13.73)
IRQ: length 15.3
  Top Layer w0.254: v1(15.24,15.89) 9.91,15.89 H10.8 ; U3.32 17.39,9.81 16.64,10.56 v1(16.51,10.56)
  Bottom Layer w0.254: v1(16.51,10.56) 16.51,14.62 v1(15.24,15.89)
MISO: length 8.2
  Top Layer w0.254: H10.7 11.3,14.5 13.49,12.31 U3.27
MOSI: length 10.8
  Top Layer w0.254: H10.6 9.78,10.69 12.45,10.69 13.57,11.81 U3.28
RST: length 39.3
  Top Layer w0.254: v1(25.15,10.81) 26.85,10.81 U3.7 ; v1(53.72,17.42) 56.49,17.42 57.8,18.73 57.8,20.34
  Bottom Layer w0.254: v1(53.72,17.42) 50.17,17.42 43.56,10.81 v1(25.15,10.81)
RX1: length 34
  Top Layer w0.254: U3.31 19.43,10.31 20.07,9.67 v1(22.23,9.67)
  Bottom Layer w0.254: v1(22.23,9.67) 42.93,9.67 H11.3
SCK: length 8.3
  Top Layer w0.254: U3.26 14.51,12.81 v1(13.72,13.61)
  Bottom Layer w0.254: H10.5 12.7,13.61 v1(13.72,13.61)
TX1: length 31.7
  Top Layer w0.254: U3.30 19.94,10.81 v1(19.94,10.81)
  Bottom Layer w0.254: v1(19.94,10.81) 22.48,8.27 41.78,8.27 H11.2
$1N1468: length 3.3
  Top Layer w0.254: 48.39,14.36 48.39,11.31 U2.3
$1N2320: length 1.8
  Top Layer w0.254: R9.1 49.14,17.42
$1N2563: length 4.2
  Top Layer w0.254: 61.11,23.26 60.71,23.67 60.71,27.31 R10.1
$1N2663: length 1.9
  Top Layer w0.254: R12.1 51.98,6.11 LED2.1
$1N3311: length 9.6
  Top Layer w0.254: X1.1 31.15,11.08 C18.1 30.21,10.31 U3.6
$1N3317: length 9.6
  Top Layer w0.254: U3.5 30.2,9.81 C17.1 34.51,5.5 X1.2

## Copper pours and planes (outline as drawn; the poured copper is in the pictures)
3V3 on Top Layer: 46.8,9.8 47.12,9.48 47.12,8.02 46.86,7.77 39.75,7.77 39.37,8.15 39.37,9.42 39.75,9.8
+5V on Top Layer: 61.4,7.31 48.94,7.31 47.88,8.36 47.88,9.54 53.34,9.54 54.71,10.91 61.4,10.91
GND on Top Layer: 41.15,10.67 41.58,10.24 45.13,10.24 45.13,11.45 45.54,11.86 46.88,11.86 47.2,12.18 47.2,13.04 46.86,13.38 46.08,13.38 45.85,13.61 45.85,15.39 44.7,16.53 42.29,16.53 41.15,15.39
GND on Top Layer: 58.93,17.54 56.9,15.51 58.04,14.37 61.6,14.37 61.6,21.48 60.83,22.24 58.93,22.24
GND on Top Layer: 51.69,16.53 59.82,16.53 61.58,14.76 61.58,12.13 60.77,11.32 54.36,11.32 52.96,9.92 48.01,9.92 48.01,10.31 48.17,10.48 49.19,10.48 49.66,10.94 49.66,14.5
GND on Top Layer: 45.4,14.18 46.23,15 49.15,15 49.66,14.5 49.66,14.37 52.32,14.88 52.32,16.17 51.78,16.55 43.03,16.55

Small or netless copper shapes (teardrops, artwork), in the pictures only: 30 on Top Layer, 2 on Bottom Layer

## Text on the board
Top Silkscreen Layer: IRQ | B1 | MISO | SCK | CE | GND | B0 | A7 | A6 | A4 | A3 | A1 | TX1 | RX1 | A2 | 3V3 | +VIN | S | MO | RST | BOOT | Date20240523 | CSN
